# Altium project MIC29302.PrjPcb
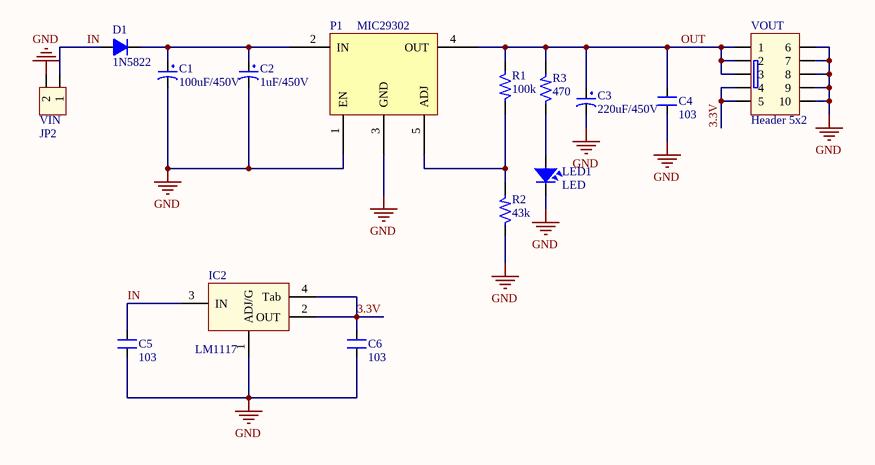
[diagram p0: Sheet2.SchDoc]
1 sheet, 15 parts. Net scope: global (net labels, ports and power ports of the same name join across sheets).
Board files: MIC29302.PcbDoc, demo.PcbDoc

## Sheet Sheet2.SchDoc
size A

### Parts
C1  100uF/450V  [CAP-D8-220uF/16V]
C2  1uF/450V  [CAP0805]
C3  220uF/450V  [CAP-D8-220uF/16V]
C4  103  [SM-0805]
C5  103  [SM-0805]
C6  103  [SM-0805]
D1  1N5822  [Diode1206]
IC2  LM1117  [SOT223-4N]
LED1  LED  [LED-5-RED]
P1  MIC29302  [LM2576_TO-263]
R1  100k  [RES0805]
R2  43k  [RES0805]
R3  470  [RES0805]
VIN  JP2  [DC-IN]
VOUT  Header 5x2  [HED2X5_cen]

### Nets
GND: C1.2 C2.2 C3.2 C4.1 C5.1 C6.1 IC2.1(ADJ/G) LED1.2 P1.1(EN) P1.3(GND) R2.1 VIN.2 VOUT.6 VOUT.7 VOUT.8 VOUT.9 VOUT.10
3.3V: C6.2 IC2.2(OUT) IC2.4(Tab) VOUT.4 VOUT.5
IN: C5.2 D1.1(A) IC2.3(IN) VIN.1
OUT: C3.1 C4.2 P1.4(OUT) R1.1 R3.2 VOUT.1 VOUT.2 VOUT.3
NetC1_1: C1.1 C2.1 D1.2(K) P1.2(IN)
NetLED1_1: LED1.1 R3.1
NetP1_5: P1.5(ADJ) R1.2 R2.2

### Library data of the parts
C1 C2 = CP9: Cap 10000uF/63V; Value: 220uF/450V
C3 = CP9: Cap 10000uF/63V; Value: 220uF/450V
C4-C6 = CM: Cap SMD; Value: 103
D1 = D5A: Diode 5A; Value: 1N5408
IC2 = LM1117: 3v3; Value: LM317
LED1 = LED: LED Single colour Green and Red; Value: LED 3 ly Single Colour
P1 = LM2576: ___Creat___: 2013/10/02
R1-R3 = R: Resistor 1/4W; Value: R1/4W - 1K
VIN = Con2: Connector 2; Value: Connector 2
VOUT = HED5x2: Value: Header 5x2